# EAGLE design trashotron-v1 (EAGLE 9.6.2)
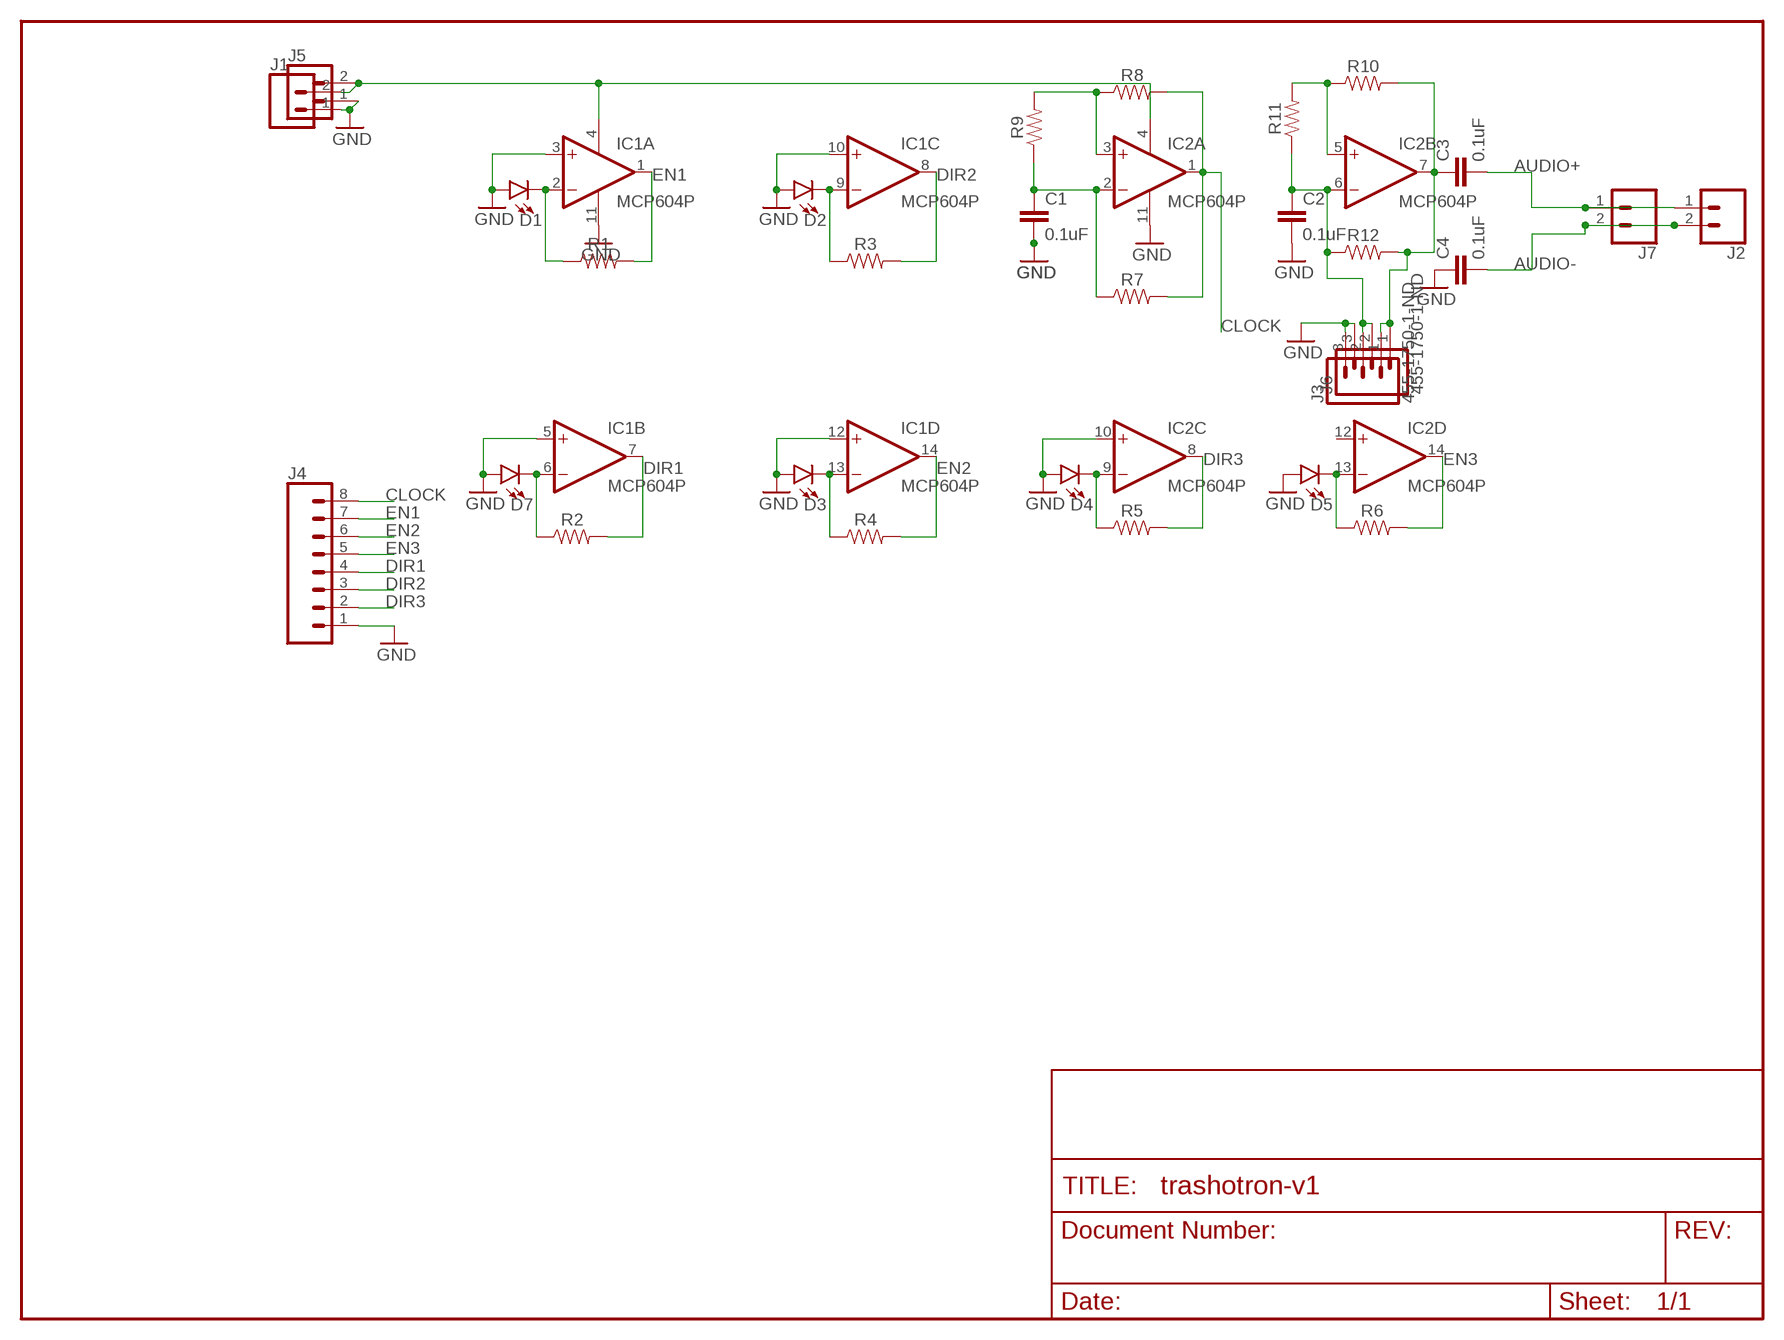
[diagram p0: schematic, sheet 1]

## Parts
C1  0.1uF  0.1UF-KIT-EZ-50V-20%  [CAP-PTH-SMALL-KIT]
C2  0.1uF  0.1UF-KIT-EZ-50V-20%  [CAP-PTH-SMALL-KIT]
C3  0.1uF  0.1UF-KIT-EZ-50V-20%  [CAP-PTH-SMALL-KIT]
C4  0.1uF  0.1UF-KIT-EZ-50V-20%  [CAP-PTH-SMALL-KIT]
D1  LED3MM  [LED_3MM]
D2  LED3MM  [LED_3MM]
D3  LED3MM  [LED_3MM]
D4  LED3MM  [LED_3MM]
D5  LED3MM  [LED_3MM]
D7  LED3MM  [LED_3MM]
IC1  MCP604P  [DIL14]
IC2  MCP604P  [DIL14]
J1  CONN_02  [1X02]
J2  CONN_02  [1X02]
J3  455-1750-1-ND  CONN_03  [1X03]
J4  CONN_08"  [1X08]
J5  CONN_02  [1X02]
J6  455-1750-1-ND  CONN_03  [1X03]
J7  CONN_02  [1X02]
R1  RESISTORAXIAL-0.3  [AXIAL-0.3]
R2  RESISTORAXIAL-0.3  [AXIAL-0.3]
R3  RESISTORAXIAL-0.3  [AXIAL-0.3]
R4  RESISTORAXIAL-0.3  [AXIAL-0.3]
R5  RESISTORAXIAL-0.3  [AXIAL-0.3]
R6  RESISTORAXIAL-0.3  [AXIAL-0.3]
R7  RESISTORAXIAL-0.3  [AXIAL-0.3]
R8  RESISTORAXIAL-0.3  [AXIAL-0.3]
R9  RESISTORAXIAL-0.3  [AXIAL-0.3]
R10  RESISTORAXIAL-0.3  [AXIAL-0.3]
R11  RESISTORAXIAL-0.3  [AXIAL-0.3]
R12  RESISTORAXIAL-0.3  [AXIAL-0.3]

## Nets
AUDIO+: C3.2 J2.1 J7.1
AUDIO-: C4.2 J2.2 J7.2
CLOCK: IC2.1(A:OUT) J4.8 R7.P$2 R8.P$2
DIR1: IC1.7(B:OUT) J4.4 R2.P$2
DIR2: IC1.8(C:OUT) J4.3 R3.P$2
DIR3: IC2.8(C:OUT) J4.2 R5.P$2
EN1: IC1.1(A:OUT) J4.7 R1.P$2
EN2: IC1.14(D:OUT) J4.6 R4.P$2
EN3: IC2.14(D:OUT) J4.5 R6.P$2
GND: C1.2 C2.2 C4.1 D1.A D2.A D3.A D4.A D5.A D7.A IC1.3(A:+IN) IC1.5(B:+IN) IC1.10(C:+IN) IC1.11(P:V-) IC1.12(D:+IN) IC2.10(C:+IN) IC2.11(P:V-) J1.1 J3.3 J4.1 J5.1 J6.3
N$1: D1.K(C) IC1.2(A:-IN) R1.P$1
N$5: D7.K(C) IC1.6(B:-IN) R2.P$1
N$7: D2.K(C) IC1.9(C:-IN) R3.P$1
N$9: D4.K(C) IC2.9(C:-IN) R5.P$1
N$11: D5.K(C) IC2.13(D:-IN) R6.P$1
N$13: D3.K(C) IC1.13(D:-IN) R4.P$1
N$15: C2.1 IC2.6(B:-IN) J3.2 J6.2 R11.P$1 R12.P$1
N$16: IC2.3(A:+IN) R8.P$1 R9.P$2
N$18: IC2.5(B:+IN) R10.P$1 R11.P$2
N$19: IC1.4(P:V+) IC2.4(P:V+) J1.2 J5.2
N$24: C1.1 IC2.2(A:-IN) R7.P$1 R9.P$1
N$25: C3.1 IC2.7(B:OUT) J3.1 J6.1 R10.P$2 R12.P$2
Unconnected: IC2.12(D:+IN)

## Library data of the parts
C1-C4 = SparkFun-Capacitors:0.1UF: 0.1µF ceramic capacitors A capacitor is a passive two-terminal electrical component used to store electrical energy temporarily in an electric field.; PROD_ID: CAP-08370
D1-D5 D7 = SparkFun-LED:LED: LED (Generic) Standard schematic elements and footprints for 5mm, 3mm, 1206, and 0603 sized LEDs. Generic LEDs with no color specified.; PROD_ID: DIO-08794
IC1 IC2 = linear:MCP604: Quad Op Amp 2.7V to 6.0V Single Supply CMOS Source: http://ww1.microchip.com/downloads/en/DeviceDoc/21314g.pdf
J1 J2 J5 J7 = SparkFun-Connectors:CONN_02: Multi connection point. Often used as Generic Header-pin footprint for 0.1 inch spaced/style header connections On any of the 0.1 inch spaced packages, you can populate with these: Break Away Headers - Straight <https://www.sparkfun.com/products/116> (PRT-00116) Break Away Male Headers - Right Angle <https://www.sparkfun.com/products/553> (PRT-00553) Female Headers <https://www.sparkfun.com/products/115> (PRT-00115) Break Away Headers - Machine Pin <https://www.sparkfun.com/products/117> (PRT-00117) Break Away Female Headers - Swiss Machine Pin <https://www.sparkfun.com/products/743> (PRT-00743) For SCREWTERMINALS and SPRING TERMINALS visit here: Screw Terimnals on SparkFun.com <https://www.sparkfun.com/search/results?term=Screw+Terminals> (5mm/3.5mm/2.54mm spacing) This device is also useful as a general connection point to wire up your design to another part of your project. Our various solder wires solder well into these plated through hole pads. Hook-Up Wire - Assortment (Stranded, 22 AWG) <https://www.sparkfun.com/products/11375> (PRT-11375) Hook-Up Wire - Assortment (Solid Core, 22 AWG) <https://www.sparkfun.com/products/11367> (PRT-11367) View the entire wire category on our website here <https://www.sparkfun.com/categories/141> Special notes: Molex polarized connector foot print use with: PRT-08233 with associated crimp pins and housings. 2.54_SCREWTERM for use with PRT-10571. 3.5mm Screw Terminal footprints for PRT-08084 5mm Screw Terminal footprints for use with PRT-08432
J3 J6 = SparkFun-Connectors:CONN_03: Multi connection point. Often used as Generic Header-pin footprint for 0.1 inch spaced/style header connections On any of the 0.1 inch spaced packages, you can populate with these: Break Away Headers - Straight <https://www.sparkfun.com/products/116> (PRT-00116) Break Away Male Headers - Right Angle <https://www.sparkfun.com/products/553> (PRT-00553) Female Headers <https://www.sparkfun.com/products/115> (PRT-00115) Break Away Headers - Machine Pin <https://www.sparkfun.com/products/117> (PRT-00117) Break Away Female Headers - Swiss Machine Pin <https://www.sparkfun.com/products/743> (PRT-00743) Stackable Header - 3 Pin (Female, 0.1") <https://www.sparkfun.com/products/13875> (PRT-13875) For SCREWTERMINALS and SPRING TERMINALS visit here: Screw Terimnals on SparkFun.com <https://www.sparkfun.com/search/results?term=Screw+Terminals> (5mm/3.5mm/2.54mm spacing) This device is also useful as a general connection point to wire up your design to another part of your project. Our various solder wires solder well into these plated through hole pads. Hook-Up Wire - Assortment (Stranded, 22 AWG) <https://www.sparkfun.com/products/11375> (PRT-11375) Hook-Up Wire - Assortment (Solid Core, 22 AWG) <https://www.sparkfun.com/products/11367> (PRT-11367) View the entire wire category on our website here <https://www.sparkfun.com/categories/141> Special notes: Molex polarized connector foot print use with SKU : PRT-08232 with associated crimp pins and housings.; PROD_ID: XXX-00000
J4 = SparkFun-Connectors:CONN_08: Multi connection point. Often used as Generic Header-pin footprint for 0.1 inch spaced/style header connections On any of the 0.1 inch spaced packages, you can populate with these: Break Away Headers - Straight <https://www.sparkfun.com/products/116> (PRT-00116) Break Away Male Headers - Right Angle <https://www.sparkfun.com/products/553> (PRT-00553) Female Headers <https://www.sparkfun.com/products/115> (PRT-00115) Break Away Headers - Machine Pin <https://www.sparkfun.com/products/117> (PRT-00117) Break Away Female Headers - Swiss Machine Pin <https://www.sparkfun.com/products/743> (PRT-00743) Arduino Stackable Header - 8 Pin <https://www.sparkfun.com/products/9279> (PRT-09279) For SCREWTERMINALS and SPRING TERMINALS visit here: Screw Terimnals on SparkFun.com <https://www.sparkfun.com/search/results?term=Screw+Terminals> (5mm/3.5mm/2.54mm spacing) This device is also useful as a general connection point to wire up your design to another part of your project. Our various solder wires solder well into these plated through hole pads. Hook-Up Wire - Assortment (Stranded, 22 AWG) <https://www.sparkfun.com/products/11375> (PRT-11375) Hook-Up Wire - Assortment (Solid Core, 22 AWG) <https://www.sparkfun.com/products/11367> (PRT-11367) View the entire wire category on our website here <https://www.sparkfun.com/categories/141> Special notes: Molex polarized connector foot print use with SKU : PRT-08231 with associated crimp pins and housings. 1MM SMD Version SKU: PRT-10208 NOTES ON THE VARIANTS LOCK and LOCK_LONGPADS... This footprint was designed to help hold the alignment of a through-hole component (i.e. 6-pin header) while soldering it into place. You may notice that each hole has been shifted either up or down by 0.005 of an inch from it's more standard position (which is a perfectly straight line). This slight alteration caused the pins (the squares in the middle) to touch the edges of the holes. Because they are alternating, it causes a "brace" to hold the component in place. 0.005 has proven to be the perfect amount of "off-center" position when using our standard breakaway headers. Although looks a little odd when you look at the bare footprint, once you have a header in there, the alteration is very hard to notice. Also,if you push a header all the way into place, it is covered up entirely on the bottom side.; PROD_ID: CONN-08438
R1-R12 = SparkFun-Resistors:RESISTOR: Generic Resistor Package

## Net classes
0 default: width 0.203 mm
1 vcc: width 0.254 mm

## Board
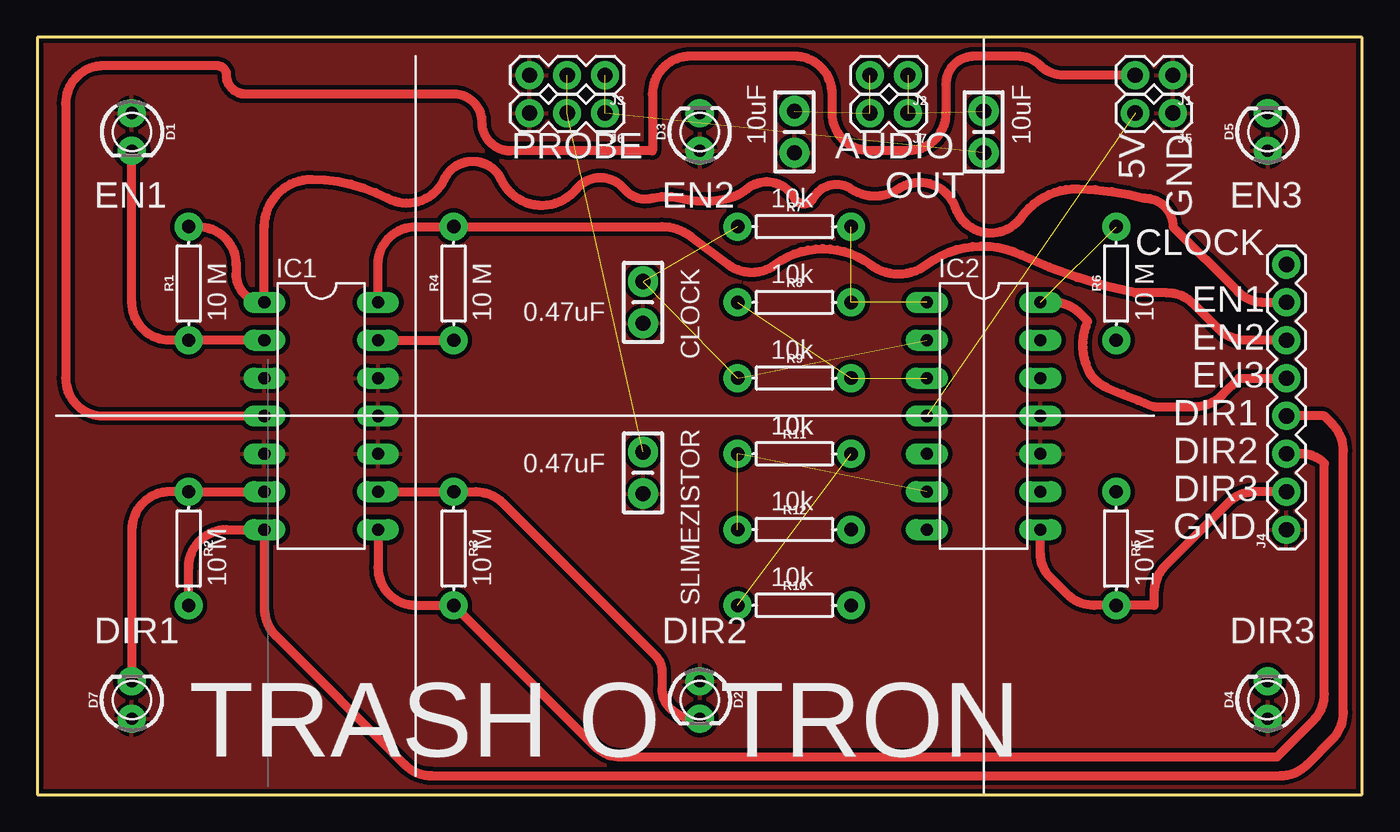
[diagram p1: board, top side]
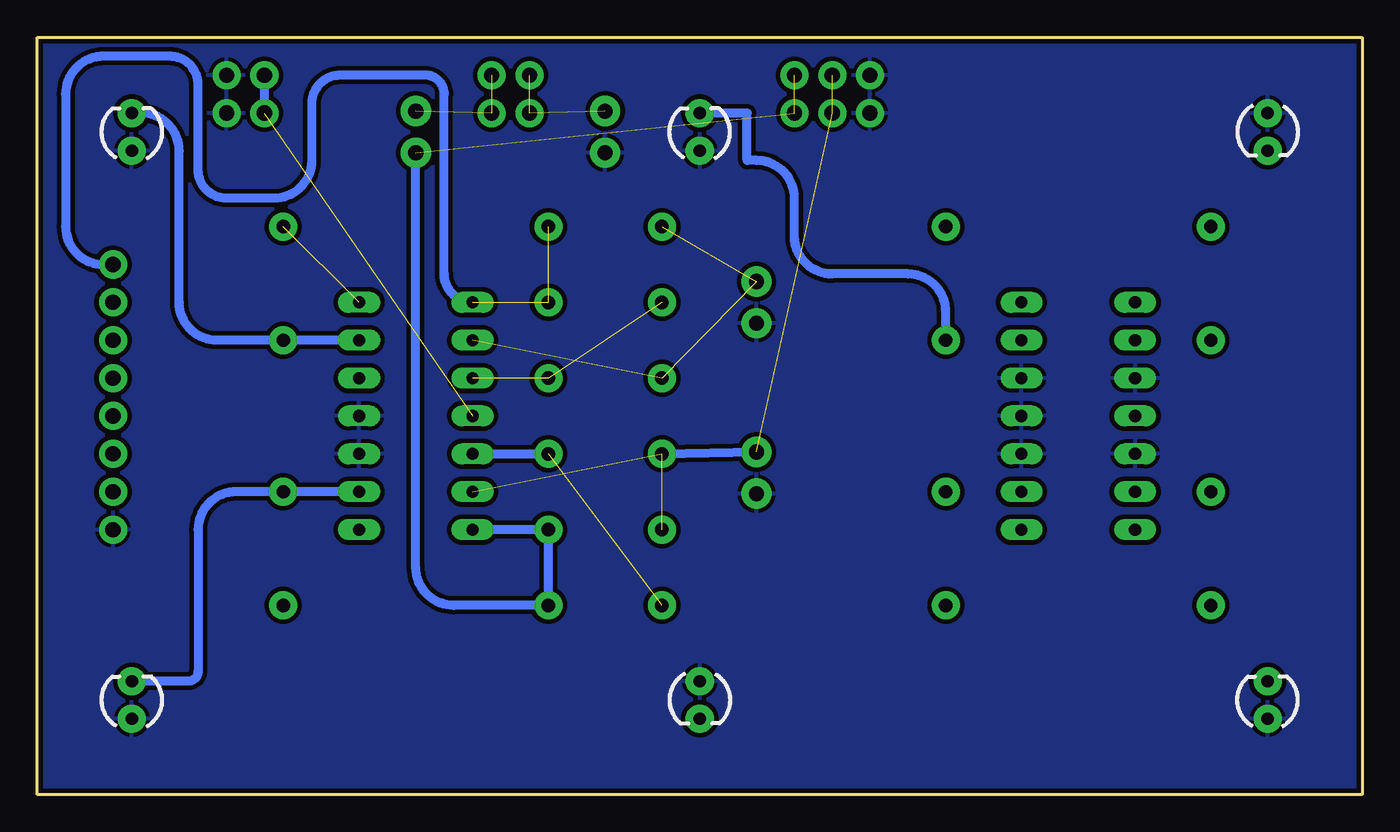
[diagram p2: board, bottom side, seen from below]

Size 88.9 x 50.8 mm. Coordinates in mm from the lower left corner, seen from the top.
Outline: 0,50.8 0,0 88.9,0 88.9,50.8 0,50.8
Copper layers (1*16): Top 0.035mm / dielectric 1.5mm / Bottom 0.035mm
Design rules "default": minimum track width 8mil, minimum drill 20mil, track to track 8mil, track to pad 8mil, pad to pad 8mil, via to via 8mil, smd to smd 8mil, copper to edge 10mil, drill to drill 8mil, minimum pad ring 12mil, minimum via ring 10mil, stop-mask expansion 4mil, vias tented up to drill 25mil, thermal gap 10mil

### Footprints (pad centres in the part's own frame; a part is rotated, then mirrored left to right if it is on the bottom)
CAP-PTH-SMALL-KIT = drill 1.016 pad 2.032: 1 -1.397,0; 2 1.397,0
LED_3MM = drill 0.813 pad 1.88: A -1.27,0; K 1.27,0
DIL14 = drill 0.813 long: 1 -7.62,-3.81; 2 -5.08,-3.81; 3 -2.54,-3.81; 4 0,-3.81; 5 2.54,-3.81; 6 5.08,-3.81; 7 7.62,-3.81; 8 7.62,3.81; 9 5.08,3.81; 10 2.54,3.81; 11 0,3.81; 12 -2.54,3.81; 13 -5.08,3.81; 14 -7.62,3.81
1X02 = drill 1.016 pad 1.88: 1 0,0; 2 2.54,0
1X03 = drill 1.016 pad 1.88: 1 0,0; 2 2.54,0; 3 5.08,0
1X08 = drill 1.016 pad 1.88: 1 0,0; 2 2.54,0; 3 5.08,0; 4 7.62,0; 5 10.16,0; 6 12.7,0; 7 15.24,0; 8 17.78,0
AXIAL-0.3 = drill 0.9 pad 1.88: P$1 -3.81,0; P$2 3.81,0

### Placement (x,y rotation side)
C1  40.64,33.02 270 top
C2  40.64,21.59 270 top
C3  63.5,44.45 90 top
C4  50.8,44.45 90 top
D1  6.35,44.45 270 top
D2  44.45,6.35 270 top
D3  44.45,44.45 90 top
D4  82.55,6.35 90 top
D5  82.55,44.45 90 top
D7  6.35,6.35 90 top
IC1  19.05,25.4 270 top
IC2  63.5,25.4 270 top
J1  76.2,48.26 180 top
J2  58.42,48.26 180 top
J3  38.1,48.26 180 top
J4  83.82,17.78 90 top
J5  76.2,45.72 180 top
J6  38.1,45.72 180 top
J7  58.42,45.72 180 top
R1  10.16,34.29 90 top
R2  10.16,16.51 270 top
R3  27.94,16.51 270 top
R4  27.94,34.29 90 top
R5  72.39,16.51 270 top
R6  72.39,34.29 90 top
R7  50.8,38.1 0 top
R8  50.8,33.02 0 top
R9  50.8,27.94 0 top
R10  50.8,12.7 0 top
R11  50.8,22.86 0 top
R12  50.8,17.78 0 top

### Tracks (layer width: path | path; a pad name or v marks a point on that pad's centre or on a via)
AUDIO+  (2 unrouted)
AUDIO-  (2 unrouted)
CLOCK  (2 unrouted)
  Bottom 0.61: IC2.1 arc90 61.59,34.92 61.59,46.99 arc-90 62.87,48.26 68.58,48.26 arc-90 70.48,46.35 70.48,42.55 arc90 73.03,40.01 76.2,40.01 arc90 78.11,41.91 78.11,47.62 arc-90 80.01,49.53 84.45,49.53 arc-90 87,46.99 87,38.1 arc-90 84.45,35.56 J4.8
DIR1
  Top 0.61: J4.4 86.36,25.4 86.89,24.87 arc-45 87.63,23.08 87.63,5.5 arc-45 86.89,3.7 85.2,2.01 arc-45 83.4,1.27 26.45,1.27 arc-45 24.66,2.01 15.98,10.69 arc-45 15.24,12.48 IC1.7 12.7,17.78 arc90 10.16,15.24 R2.P$2
DIR2
  Top 0.61: J4.3 84.83,22.86 arc-45 86.36,22.23 86.36,6.77 arc-45 85.62,4.97 83.19,2.54 39.15,2.54 arc-45 37.36,3.28 R3.P$2 25.4,12.7 arc-90 22.86,15.24 IC1.8
DIR3
  Top 0.61: J4.2 81.7,20.32 arc45 79.9,19.58 75.67,15.35 arc45 74.93,13.55 74.93,12.7 R5.P$2 70.9,12.7 arc-45 69.11,13.44 67.94,14.61 arc-45 67.31,16.14 IC2.8
EN1
  Top 0.61: J4.7 82.33,33.02 arc-45 80.54,33.76 76.2,38.1 arc90 74.3,40.01 arc14 69.85,40.64 arc56 66.04,38.73 arc-125 61.59,39.37 arc105 57.78,40.64 arc-68 54.61,40.64 arc96 52.07,40.01 arc-124 50.8,40.01 arc101 47.62,40.64 arc-25 46.35,40.01 arc-28 43.18,40.01 arc28 41.27,40.01 arc-65 39.37,40.64 arc101 36.2,40.64 arc-116 31.11,41.27 arc130 27.3,41.27 arc-93 23.5,40.01 arc28 18.41,41.27 arc90 15.24,38.1 IC1.1 arc-90 13.34,34.92 13.34,35.56 arc90 10.79,38.1 R1.P$2
EN2
  Top 0.61: J4.6 81.06,30.48 arc-45 79.27,31.22 77.58,32.91 arc45 75.78,33.66 73.66,33.66 arc-14 66.04,36.2 arc62 59.69,35.56 arc-74 55.88,35.56 arc74 49.53,35.56 arc-74 46.35,35.56 43.81,37.47 arc37 41.91,38.1 R4.P$2 25.4,38.1 arc90 22.86,35.56 IC1.14
EN3  (1 unrouted)
  Top 0.61: IC2.14 68.16,33.02 arc-45 69.96,32.28 70.48,31.75 arc45 70.48,28.57 arc45 71.75,27.3 arc2 74.93,26.04 77.69,26.04 arc45 79.48,26.78 80.64,27.94 J4.5
GND
  pour Top (isolate 0.305): 0,50.8 88.9,50.8 88.9,0 0,0
  pour Bottom (isolate 0.305): 0,50.8 88.9,50.8 88.9,0 0,0
N$1
  Top 0.61: IC1.2 R1.P$1 8.89,30.48 arc-90 6.35,33.02 D1.K
N$5
  Top 0.61: D7.K 6.35,17.78 arc-90 8.89,20.32 R2.P$1 IC1.6
N$7
  Top 0.61: IC1.9 R3.P$1 29.43,20.32 arc-45 31.22,19.58 41.46,9.34 arc-45 41.91,8.26 41.91,7.09 arc45 42.44,5.82 arc45 44.23,5.08 D2.K
N$9
  Bottom 0.61: IC2.9 R5.P$1 75.56,20.32 arc-90 78.11,17.78 78.11,8.26 arc90 78.74,7.62 D4.K
N$11
  Bottom 0.61: IC2.13 R6.P$1 76.83,30.48 arc90 79.38,33.02 79.38,43.18 arc-90 81.92,45.72 D5.K
N$13
  Top 0.61: IC1.13 R4.P$1
  Bottom 0.61: R4.P$1 27.94,32.38 arc-90 30.48,34.92 35.56,34.92 arc90 38.1,37.47 38.1,40.01 arc-90 40.64,42.55 41.27,42.55 41.27,45.72 D3.K
N$15  (4 unrouted)
  Bottom 0.61: R11.P$1 C2.1
N$16  (2 unrouted)
N$18  (1 unrouted)
  Bottom 0.61: IC2.5 R11.P$2
N$19  (1 unrouted)
  Top 0.61: J1.2 68.84,48.26 arc-45 67.31,48.9 arc45 65.78,49.53 62.87,49.53 arc90 60.96,47.62 60.96,45.72 arc-90 58.42,43.18 55.88,43.18 arc-90 53.34,45.72 53.34,46.99 arc90 50.8,49.53 43.81,49.53 arc90 41.27,46.99 41.27,43.18 31.75,43.18 arc-90 29.84,45.09 arc90 27.94,46.99 13.97,46.99 arc-90 12.7,48.26 arc90 12.06,48.9 4.45,48.9 arc90 1.91,46.35 1.91,27.94 arc90 4.45,25.4 IC1.4
  Bottom 0.61: J1.2 J5.2
N$24  (3 unrouted)
N$25  (2 unrouted)
  Bottom 0.61: C3.1 63.5,15.24 arc-90 60.96,12.7 R10.P$2 R12.P$2 IC2.7

### Text on the board
tPlace: 10uF | 10uF | PROBE | AUDIO / OUT | 10k | 5V | EN1 | EN2 | GND | EN3 | 10k | CLOCK | 0.47uF | 10 M | 10 M | 10 M | EN1 | 10k | EN2 | CLOCK | EN3 | 10k | 10k | DIR1 | 0.47uF | DIR2 | 10k | DIR3 | GND | 10k | 10 M | 10 M | 10 M | SLIMEZISTOR | DIR1 | DIR2 | DIR3 | TRASH O TRON
tValues: Tent Vias! | Arduino Wee v1.3